# EasyEDA Pro project ADA4530_2025-03-15.epro, schematic Schematic4
Board Name: ADA4530-1; Create Date: 2025-03-06; Page Name: P1; Project Name: yuhuiceshi; Schematic Name: Schematic4; Update Date: 2025-03-07; Company: 嘉立创EDA; Page Size: A4; Version: V1.0
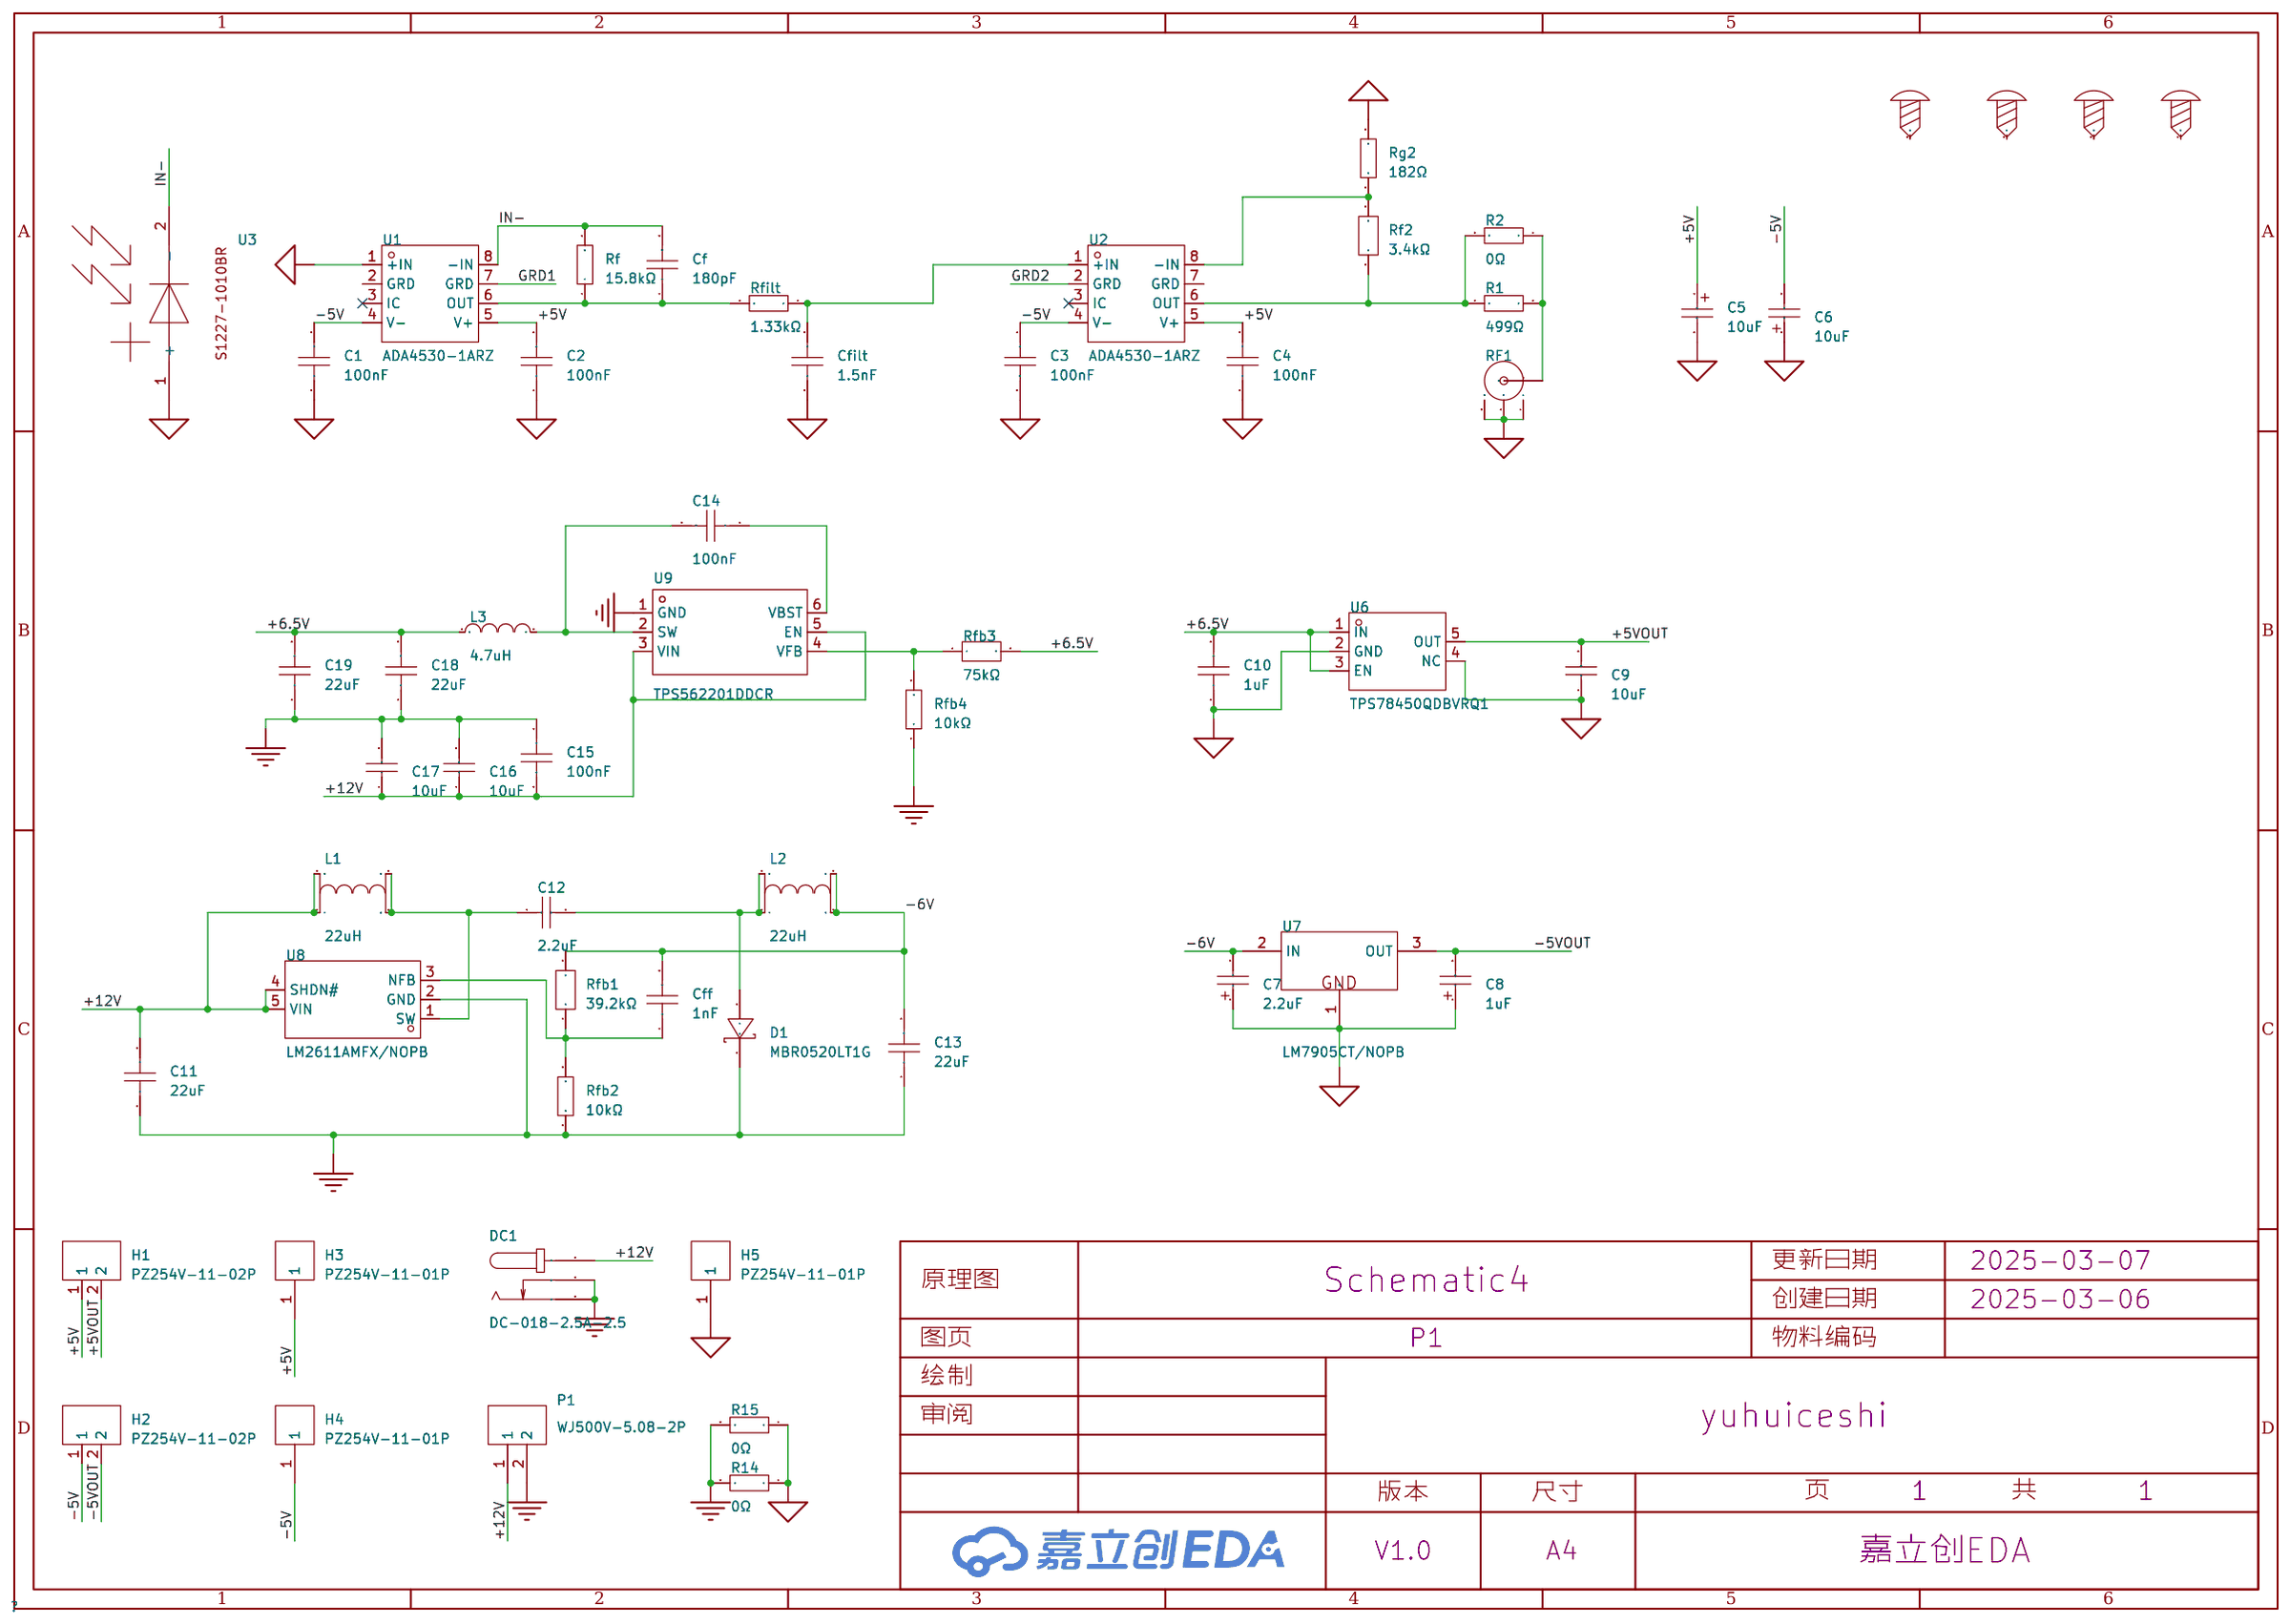
[diagram p4: schematic sheet]

## Parts
C1  100nF  [C0603]
C2  100nF  [C0603]
C3  100nF  [C0603]
C4  100nF  [C0603]
C5  10uF  [CAP-SMD_L6.0-W3.2-R-RD]
C6  10uF  [CAP-SMD_L6.0-W3.2-R-RD]
C7  2.2uF  [CASE-A_3216]
C8  1uF  [CASE-A_3216]
C9  10uF  [C1206]
C10  1uF  [C0603]
C11  22uF  [C1210]
C12  2.2uF  [C1206]
C13  22uF  [C1210]
C14  100nF  [C0603]
C15  100nF  [C0603]
C16  10uF  [C1206]
C17  10uF  [C1206]
C18  22uF  [C1210]
C19  22uF  [C1210]
Cf  180pF  [R0805]
Cff  1nF  [C0603]
Cfilt  1.5nF  [R0805]
D1  MBR0520LT1G  [SOD-123_L2.8-W1.8-LS3.7-RD]
DC1  DC-018-2.5A-2.5  [DC-IN-TH_DC-018]
H1  PZ254V-11-02P  [HDR-TH_2P-P2.54-V-M]
H2  PZ254V-11-02P  [HDR-TH_2P-P2.54-V-M]
H3  PZ254V-11-01P  [HDR-TH_1P-P2.54-V-M]
H4  PZ254V-11-01P  [HDR-TH_1P-P2.54-V-M]
H5  PZ254V-11-01P  [HDR-TH_1P-P2.54-V-M]
L1  22uH  [IND-SMD_4P-L3.8-W3.5_BL]
L2  22uH  [IND-SMD_4P-L3.8-W3.5_BL]
L3  4.7uH  [IND-SMD_L5.4-W5.2_FXL0530]
P1  WJ500V-5.08-2P  [CONN-TH_2P-P5.00_WJ500V-5.08-2P]
R1  499Ω  [R0603]
R2  0Ω  [R0603]
R14  0Ω  [R0603]
R15  0Ω  [R0603]
Rf  15.8kΩ  [R0805]
RF1  KH-BNC50-3511  [ANT-TH_KH-BNC50-3511]
Rf2  3.4kΩ  [R0805]
Rfb1  39.2kΩ  [R0805]
Rfb2  10kΩ  [R0805]
Rfb3  75kΩ  [R0805]
Rfb4  10kΩ  [R0805]
Rfilt  1.33kΩ  [R0805]
Rg2  182Ω  [R0805]
SCREW1  -  [M2螺丝]
SCREW2  -  [M2螺丝]
SCREW3  -  [M2螺丝]
SCREW4  -  [M2螺丝]
U1  ADA4530-1ARZ  [SOIC-8_L4.9-W3.9-P1.27-LS6.0-BL]
U2  ADA4530-1ARZ  [SOIC-8_L4.9-W3.9-P1.27-LS6.0-BL]
U3  -  [S1227-1010BR]
U6  TPS78450QDBVRQ1  [SOT-23-5_L2.9-W1.6-P0.95-LS2.8-BL]
U7  LM7905CT/NOPB  [TO-220-3_L10.0-W4.5-P2.54-L]
U8  LM2611AMFX/NOPB  [SOT-23-5_L2.9-W1.6-P0.95-LS2.8-BR]
U9  TPS562201DDCR  [SOT-23-6_L2.9-W1.6-P0.95-LS2.8-BR]

## Library data of the parts
C1-C4 C14 C15 = CC0603KRX7R9BB104: 容值:100nF;精度:±10%;额定电压:50V;材质(温度系数):X7R;; LCSC Part Name: 100nF ±10% 50V; Supplier Part: C14663; Manufacturer: YAGEO(国巨); Supplier Footprint: 0603; JLCPCB Part Class: 基础库; Datasheet: https://atta.szlcsc.com/upload/public/pdf/source/20180910/C282072_33301C7F631E79921B82A8DAC6BCC5B3.pdf; Supplier: LCSC; Tolerance: ±10%; Voltage Rated: 50V; Temperature Coefficient: X7R
C5 C6 = TAJC106K025RNJ: 容值:10uF;精度:±10%;额定电压:25V;等效串联电阻:1.8Ω@100kHz;; LCSC Part Name: 10uF ±10% 25V; Supplier Part: C7210; Manufacturer: Kyocera AVX; Supplier Footprint: CASE-C-6032; JLCPCB Part Class: Extended Part; Datasheet: https://atta.szlcsc.com/upload/public/pdf/source/20160107/1457707750344.pdf; Supplier: LCSC; Tolerance: ±10%; Rated Voltage: 25V; Equivalent Series Resistance(ESR): 1.8Ω@100kHz; Operating Temperature: -55℃~+125℃
C7 = TAJA225K016RNJ: 容值:2.2uF;精度:±10%;额定电压:16V;等效串联电阻:6.5Ω@100kHz;; LCSC Part Name: 2.2uF ±10% 16V; Supplier Part: C7180; Manufacturer: Kyocera AVX; Supplier Footprint: CASE-A-3216; JLCPCB Part Class: 扩展库; Datasheet: https://atta.szlcsc.com/upload/public/pdf/source/20160107/1457707750344.pdf; Supplier: LCSC; Tolerance: ±10%; Rated Voltage: 16V; Equivalent Series Resistance(ESR): 6.5Ω@100kHz; Operating Temperature: -55℃~+125℃
C8 = TAJA105K016RNJ: 容值:1uF;精度:±10%;额定电压:16V;等效串联电阻:11Ω;; LCSC Part Name: 1uF ±10% 16V; Supplier Part: C7174; Manufacturer: Kyocera AVX; Supplier Footprint: CASE-A-3216; JLCPCB Part Class: 扩展库; Datasheet: https://atta.szlcsc.com/upload/public/pdf/source/20160107/1457707750344.pdf; Supplier: LCSC; Tolerance: ±10%; Rated Voltage: 16V; Equivalent Series Resistance(ESR): 11Ω; Operating Temperature: -55℃~+125℃
C9 C16 C17 = CL31A106KAHNNNE: 容值:10uF;精度:±10%;额定电压:25V;材质(温度系数):X5R;; LCSC Part Name: 10uF ±10% 25V; Supplier Part: C9807; Manufacturer: SAMSUNG(三星); Supplier Footprint: 1206; JLCPCB Part Class: 扩展库; Datasheet: https://atta.szlcsc.com/upload/public/pdf/source/20160218/1457707763339.pdf; Supplier: LCSC; Tolerance: ±10%; Voltage Rated: 25V; Temperature Coefficient: X5R
C10 = CL10A105KB8NNNC: 容值:1uF;精度:±10%;额定电压:50V;材质(温度系数):X5R;; LCSC Part Name: 1uF ±10% 50V; Supplier Part: C15849; Manufacturer: SAMSUNG(三星); Supplier Footprint: 0603; JLCPCB Part Class: 基础库; Datasheet: https://atta.szlcsc.com/upload/public/pdf/source/20160218/1457707763339.pdf; Supplier: LCSC; Tolerance: ±10%; Voltage Rated: 50V; Temperature Coefficient: X5R
C11 C13 C18 C19 = GMK325BJ226MM-P: 容值:22uF;精度:±20%;额定电压:35V;材质(温度系数):X5R;; LCSC Part Name: 22uF ±20% 35V; Supplier Part: C778721; Manufacturer: TAIYO YUDEN(太诱); Supplier Footprint: 1210; JLCPCB Part Class: 扩展库; Datasheet: https://atta.szlcsc.com/upload/public/pdf/source/20200107/C471398_4D150C2F82D9DF0CFE325EE548591887.pdf; Supplier: LCSC; Tolerance: ±20%; Voltage Rated: 35V; Temperature Coefficient: X5R
C12 = CC1206KKX7R7BB225: 容值:2.2uF;精度:±10%;额定电压:16V;材质(温度系数):X7R;; LCSC Part Name: 2.2uF ±10% 16V; Supplier Part: C107183; Manufacturer: YAGEO(国巨); Supplier Footprint: 1206; JLCPCB Part Class: 扩展库; Datasheet: https://atta.szlcsc.com/upload/public/pdf/source/20170914/C128857_1505359892143968080.pdf; Supplier: LCSC; Tolerance: ±10%; Voltage Rated: 16V; Temperature Coefficient: X7R
Cf = 0805CG181J500NT: 容值:180pF;精度:±5%;额定电压:50V;材质(温度系数):C0G;; LCSC Part Name: 180pF ±5% 50V; Supplier Part: C501859; Manufacturer: FH(风华); Supplier Footprint: 0805; JLCPCB Part Class: 扩展库; Datasheet: https://atta.szlcsc.com/upload/public/pdf/source/20200305/C486355_26A10D38EF8C2A5C37091D0039909270.pdf; Supplier: LCSC; Tolerance: ±5%; Voltage Rated: 50V; Temperature Coefficient: C0G
Cff = GRM1885C1H102JA01D: 容值:1nF;精度:±5%;额定电压:50V;材质(温度系数):C0G;; LCSC Part Name: 1nF ±5% 50V; Supplier Part: C77026; Manufacturer: muRata(村田); Supplier Footprint: 0603; JLCPCB Part Class: 扩展库; Datasheet: https://atta.szlcsc.com/upload/public/pdf/source/20200305/C490387_23319AE8C154DEB24C505E6C82A8106A.pdf; Supplier: LCSC; Tolerance: ±5%; Voltage Rated: 50V; Temperature Coefficient: C0G
Cfilt = CC0805FRNPO9BN152: 容值:1.5nF;精度:±1%;额定电压:50V;材质(温度系数):NP0;; LCSC Part Name: 1.5nF ±1% 50V; Supplier Part: C541572; Manufacturer: YAGEO(国巨); Supplier Footprint: 0805; JLCPCB Part Class: 扩展库; Datasheet: https://atta.szlcsc.com/upload/public/pdf/source/20200615/C541572_75B017E42B81E12B0DEAEB7B17D8F495.pdf; Supplier: LCSC; Tolerance: ±1%; Voltage Rated: 50V; Temperature Coefficient: NP0
D1 = MBR0520LT1G: 正向压降(Vf):385mV@500mA;直流反向耐压(Vr):20V;平均整流电流(Io):500mA;; LCSC Part Name: 电压:20V 电流:500mA; Supplier Part: C23848; Manufacturer: onsemi(安森美); Supplier Footprint: SOD-123; JLCPCB Part Class: 扩展库; Datasheet: https://atta.szlcsc.com/upload/public/pdf/source/20200107/C165467_B46770004CC25E9EEC451D5DBE275EFE.pdf; Supplier: LCSC; Forward Voltage (Vf@If): 385mV@500mA; Reverse Voltage (Vr): 20V; Average Rectified Current (Io): 500mA; Reverse Leakage Current (Ir): 250uA@20V
DC1 = DC-018-2.5A-2.5: 连接器类型:DC电源插座;安装方式:直插;触点内径:2.5mm;触点外径:5.5mm;额定电流:2.5A;额定电压:24V;工作温度范围:-20℃~+70℃;; LCSC Part Name: DC电源插座 内径:2.5mm 外径:5.5mm; Supplier Part: C2880553; Manufacturer: XKB Connection(中国星坤); Supplier Footprint: 插件; JLCPCB Part Class: 扩展库; Datasheet: https://atta.szlcsc.com/upload/public/pdf/source/20211011/841513E81FE39239E013AD10F679532A.pdf; Supplier: LCSC; Connector Type: DC电源插座; Mounting Style: 直插; Inside Contact Diameter: 2.5mm; Outside Contact Diameter: 5.5mm; Current Rating (Max): 2.5A; Voltage Rating (Max): 24V; Operating Temperature Range: -20℃~+70℃
H1 H2 = PZ254V-11-02P: 插针结构:1x2P;间距:2.54mm;行距:-;圆针/方针:方针;安装类型:直插;排数:单排;总PIN位数:2P;额定电流:-;额定电压:-;配合针长度:6mm;塑高:2.5mm;端接针长度:3mm;触头材质:黄铜;触头镀层:-;工作温度范围:-40℃~+105℃;颜色:黑色;; LCSC Part Name: 间距:2.54mm 1x2P 直插 方针; Supplier Part: C492401; Manufacturer: XFCN(兴飞); Supplier Footprint: 插件,P=2.54mm; JLCPCB Part Class: 扩展库; Datasheet: https://atta.szlcsc.com/upload/public/pdf/source/20200309/C492401_A812433581A9B211A7FFA413ADDFF0E5.pdf; Supplier: LCSC; Pin Structure: 1x2P; Pitch: 2.54mm; Circluar Pins/Square Pins: 方针; Mounting Type: 直插; Number of Rows: 单排; Number of Pins: 2P; Length of Mating Pin: 6mm; Insulation Height: 2.5mm; Length of End Connection Pin: 3mm; Contact Material: 黄铜; Operating Temperature Range: -40℃~+105℃; Color: 黑色
H3-H5 = PZ254V-11-01P: 插针结构:1x1P;间距:2.54mm;行距:-;圆针/方针:方针;安装方式:直插;排数:单排;总PIN位数:1P;额定电流:-;额定电压:-;配合针长度:6mm;塑高:2.5mm;端接针长度:3mm;触头材质:黄铜;触头镀层:-;工作温度:-40℃~+105℃;颜色:黑色;; LCSC Part Name: 1x1P 间距:2.54mm 方针 直插; Supplier Part: C492400; Manufacturer: XFCN(兴飞); Supplier Footprint: 插件,P=2.54mm; JLCPCB Part Class: 扩展库; Datasheet: https://atta.szlcsc.com/upload/public/pdf/source/20200309/C492400_46876A5B545F5AE6B8D4A09C46E276E8.pdf; Supplier: LCSC; Pin Structure: 1x1P; Pitch: 2.54mm; Circluar Pins/Square Pins: 方针; Mounting Type: 直插; Number of Rows: 单排; Number of Pins: 1P; Length of Mating Pin: 6mm; Insulation Height: 2.5mm; Length of End Connection Pin: 3mm; Contact Material: 黄铜; Operating Temperature: -40℃~+105℃; Color: 黑色
L1 L2 = CR32NP-220KC: 电感值:22uH;精度:±10%;额定电流:500mA;饱和电流(Isat):-;类型:-;; LCSC Part Name: 22uH ±10%; Supplier Part: C167313; Manufacturer: Sumida(胜美达); Supplier Footprint: SMD-4P,3.8x3.5mm; JLCPCB Part Class: 扩展库; Datasheet: https://atta.szlcsc.com/upload/public/pdf/source/20180224/C167313_15194366459971363664.pdf; Supplier: LCSC; Tolerance: ±10%; Rated Current: 500mA; DC Resistance (DCR): 470mΩ
L3 = FXL0530-4R7-M: 电感值:4.7uH;精度:±20%;额定电流:4.5A;饱和电流(Isat):5A;类型:一体成型电感;; LCSC Part Name: 4.7uH ±20% 5A; Supplier Part: C177246; Manufacturer: cjiang(长江微电); Supplier Footprint: SMD,5.2x5.4mm; JLCPCB Part Class: 扩展库; Datasheet: https://atta.szlcsc.com/upload/public/pdf/source/20240426/3189EA8206330E2108542F9E34E540E7.pdf; Supplier: LCSC; Tolerance: ±20%; Rated Current: 4.5A; Saturation Current (Isat): 5A; DC Resistance (DCR): 60mΩ; Type: 一体成型电感
P1 = WJ500V-5.08-2P: 结构:1x2P;间距:5.08mm;颜色:绿色;安装方式:直插;额定电流:18A;额定电压:250V;排数:1;线规 - AWG:14~30;线规 - 平方毫米:2.5;每排PIN数:2;触头材质:-;触头镀层:-;工作温度范围:-40℃~+105℃;焊接温度(最大值):-;; LCSC Part Name: 1x2P 5.08mm 直插 排数:1 每排P数:2; Supplier Part: C8465; Manufacturer: KANGNEX(康奈克斯电气); Supplier Footprint: 插件,P=5.08mm; JLCPCB Part Class: 扩展库; Datasheet: https://atta.szlcsc.com/upload/public/pdf/source/20191225/C8465_02D34CE5B5B4A53DF5891601D97FA9F4.pdf; Supplier: LCSC; Structure: 1x2P; Pitch: 5.08mm; Color: 绿色; Mounting Style: 直插; Current Rating (Max): 18A; Voltage Rating (Max): 250V; Number of Pins: 2P; Number of Rows: 1; Wire Gauge - AWG: 14~30; Wire Gauge - mm2: 2.5; Number of PINs Per Row: 2; Operating Temperature Range: -40℃~+105℃; Screw Specification: M2.5
R1 = 0603WAF4990T5E: 电阻类型:厚膜电阻;阻值:499Ω;精度:±1%;功率:100mW;最大工作电压:75V;温度系数:±100ppm/℃;; LCSC Part Name: 499Ω ±1% 100mW 厚膜电阻; Supplier Part: C23065; Manufacturer: UNI-ROYAL(厚声); Supplier Footprint: 0603; JLCPCB Part Class: 扩展库; Datasheet: https://atta.szlcsc.com/upload/public/pdf/source/20200306/C422600_1E6D84923E4A46A82E41ADD87F860B5C.pdf; Supplier: LCSC; Type: 厚膜电阻; Tolerance: ±1%; Power(Watts): 100mW; Overload Voltage (Max): 75V; Temperature Coefficient: ±100ppm/℃; Operating Temperature Range: -55℃~+155℃
R2 R14 R15 = 0603WAF0000T5E: 电阻类型:厚膜电阻;阻值:0Ω;精度:±1%;功率:100mW;最大工作电压:75V;; LCSC Part Name: 0Ω ±1% 100mW 厚膜电阻; Supplier Part: C21189; Manufacturer: UNI-ROYAL(厚声); Supplier Footprint: 0603; JLCPCB Part Class: 基础库; Datasheet: https://atta.szlcsc.com/upload/public/pdf/source/20200306/C422600_1E6D84923E4A46A82E41ADD87F860B5C.pdf; Supplier: LCSC; Type: 厚膜电阻; Tolerance: ±1%; Power(Watts): 100mW; Overload Voltage (Max): 75V; Operating Temperature Range: -55℃~+155℃
Rf = 0805W8F1582T5E: 电阻类型:厚膜电阻;阻值:15.8kΩ;精度:±1%;功率:125mW;最大工作电压:150V;温度系数:±100ppm/℃;; LCSC Part Name: 15.8kΩ ±1% 125mW 厚膜电阻; Supplier Part: C17468; Manufacturer: UNI-ROYAL(厚声); Supplier Footprint: 0805; JLCPCB Part Class: 扩展库; Datasheet: https://atta.szlcsc.com/upload/public/pdf/source/20200306/C422600_1E6D84923E4A46A82E41ADD87F860B5C.pdf; Supplier: LCSC; Type: 厚膜电阻; Tolerance: ±1%; Power(Watts): 125mW; Overload Voltage (Max): 150V; Temperature Coefficient: ±100ppm/℃; Operating Temperature Range: -55℃~+155℃
RF1 = KH-BNC50-3511: 连接器类型:板端;接口类型:内孔;端口数量:1;接口直径:9.5mm;接口长度/高度:-;频率-最大值:3GHz;射频系列:BNC;阻抗:50Ω;样式:弯头;工作温度范围:-55℃~+155℃;; LCSC Part Name: BNC 内孔 弯头; Supplier Part: C2837587; Manufacturer: kinghelm(金航标); Supplier Footprint: 插件; JLCPCB Part Class: 扩展库; Datasheet: https://atta.szlcsc.com/upload/public/pdf/source/20221123/AFF24A942BB0EF6B7776F494013BE75C.pdf; Supplier: LCSC; Connector Type: 板端; Interface Type: 内孔; Number of Ports: 1; Interface Diameter: 9.5mm; Frequency-Max: 3GHz; RF Series: BNC; Impedance: 50Ω; Style: 弯头; Operating Temperature Range: -55℃~+155℃
Rf2 = PTFR0805B3K40P9: 电阻类型:薄膜电阻;阻值:3.4kΩ;精度:±0.1%;功率:130mW;最大工作电压:150V;温度系数:±25ppm/℃;; LCSC Part Name: 薄膜电阻 3.4kΩ ±0.1% 130mW; Supplier Part: C2849214; Manufacturer: RESI(开步睿思); Supplier Footprint: 0805; JLCPCB Part Class: 扩展库; Datasheet: https://atta.szlcsc.com/upload/public/pdf/source/20240506/11BDC7478D84177AC2A5326A65B6EB29.pdf; Supplier: LCSC; Type: 薄膜电阻; Tolerance: ±0.1%; Power(Watts): 130mW; Overload Voltage (Max): 150V; Temperature Coefficient: ±25ppm/℃; Operating Temperature Range: -55℃~+155℃
Rfb1 = RC0805FR-0739K2L: 电阻类型:厚膜电阻;阻值:39.2kΩ;精度:±1%;功率:125mW;最大工作电压:150V;温度系数:±100ppm/℃;; LCSC Part Name: 厚膜电阻 39.2kΩ ±1% 125mW; Supplier Part: C273844; Manufacturer: YAGEO(国巨); Supplier Footprint: 0805; JLCPCB Part Class: 扩展库; Datasheet: https://atta.szlcsc.com/upload/public/pdf/source/20191125/C364360_EA870FADD46A2AD4DBE56DD50D360B3E.pdf; Supplier: LCSC; Type: 厚膜电阻; Tolerance: ±1%; Power(Watts): 125mW; Overload Voltage (Max): 150V; Temperature Coefficient: ±100ppm/℃; Operating Temperature Range: -55℃~+155℃
Rfb2 Rfb4 = 0805W8F1002T5E_C17414: 电阻类型:厚膜电阻;阻值:10kΩ;精度:±1%;功率:125mW;最大工作电压:150V;温度系数:±100ppm/℃;; LCSC Part Name: 10kΩ ±1% 125mW 厚膜电阻; Supplier Part: C17414; Manufacturer: UNI-ROYAL(厚声); Manufacturer Part: 0805W8F1002T5E; Supplier Footprint: 0805; JLCPCB Part Class: 基础库; Datasheet: https://atta.szlcsc.com/upload/public/pdf/source/20200306/C422600_1E6D84923E4A46A82E41ADD87F860B5C.pdf; Supplier: LCSC; Type: 厚膜电阻; Tolerance: ±1%; Power(Watts): 125mW; Overload Voltage (Max): 150V; Temperature Coefficient: ±100ppm/℃; Operating Temperature Range: -55℃~+155℃
Rfb3 = FRC0805J753TS: 电阻类型:厚膜电阻;阻值:75kΩ;精度:±5%;功率:125mW;最大工作电压:150V;温度系数:±100ppm/℃;; LCSC Part Name: 75kΩ ±5% 125mW 厚膜电阻; Supplier Part: C2930313; Manufacturer: FOJAN(富捷); Supplier Footprint: 0805; JLCPCB Part Class: 扩展库; Datasheet: https://atta.szlcsc.com/upload/public/pdf/source/20211221/925EC7D7225764EE0046F22065062C87.pdf; Supplier: LCSC; Type: 厚膜电阻; Tolerance: ±5%; Power(Watts): 125mW; Overload Voltage (Max): 150V; Temperature Coefficient: ±100ppm/℃; Operating Temperature Range: -55℃~+155℃
Rfilt = 0805W8F1582T5E: 电阻类型:厚膜电阻;阻值:15.8kΩ;精度:±1%;功率:125mW;最大工作电压:150V;温度系数:±100ppm/℃;; LCSC Part Name: 15.8kΩ ±1% 125mW 厚膜电阻; Supplier Part: C865258; Manufacturer: YAGEO(国巨); Manufacturer Part: RT0805BRD071K33L; Supplier Footprint: 0805; JLCPCB Part Class: 扩展库; Datasheet: https://atta.szlcsc.com/upload/public/pdf/source/20200306/C422600_1E6D84923E4A46A82E41ADD87F860B5C.pdf; Supplier: LCSC; Type: 厚膜电阻; Tolerance: ±1%; Power(Watts): 125mW; Overload Voltage (Max): 150V; Temperature Coefficient: ±100ppm/℃; Operating Temperature Range: -55℃~+155℃
Rg2 = 0805W8F1820T5E: 电阻类型:厚膜电阻;阻值:182Ω;精度:±1%;功率:125mW;最大工作电压:150V;温度系数:±100ppm/℃;; LCSC Part Name: 182Ω ±1% 125mW 厚膜电阻; Supplier Part: C17503; Manufacturer: UNI-ROYAL(厚声); Supplier Footprint: 0805; JLCPCB Part Class: 扩展库; Datasheet: https://atta.szlcsc.com/upload/public/pdf/source/20200306/C422600_1E6D84923E4A46A82E41ADD87F860B5C.pdf; Supplier: LCSC; Type: 厚膜电阻; Tolerance: ±1%; Power(Watts): 125mW; Overload Voltage (Max): 150V; Temperature Coefficient: ±100ppm/℃; Operating Temperature Range: -55℃~+155℃
SCREW1-SCREW4 = M2螺丝: Supplier Footprint: 插件; Check: false
U1 U2 = ADA4530-1ARZ: 放大器数:单路;轨到轨:轨到轨输出;增益带宽积(GBP):2MHz;输入失调电压(Vos):300uV;压摆率(SR):1.4V/us;输入偏置电流(Ib):0.02pA;; LCSC Part Name: 飞安级输入偏置电流静电计放大器; Supplier Part: C654128; Manufacturer: ADI(亚德诺); Supplier Footprint: SOIC-8; JLCPCB Part Class: 扩展库; Datasheet: https://atta.szlcsc.com/upload/public/pdf/source/20200729/C654128_C8802637E08A58373167ED8215F15F2A.pdf; Supplier: LCSC; Number of Circuits: 单路; Maximum Power Supply Range (Vdd-Vss): 16V; Rail to Rail: 轨到轨输出; Gain Bandwidth Product(GBP): 2MHz; Voltage - Input Offset(Vos): 300uV; Input Offset Voltage Drift (Vos TC): 2.8uV/℃; Slew Rate(SR): 1.4V/us; Current - Input Bias(Ib): 0.02pA; Noise density(eN): 14nV/√Hz@10kHz; Common Mode Rejection Ratio (CMRR): 114dB; Output Current: 15mA; Operating Temperature: -40℃~+125℃
U3 = SiPD: Check: false
U6 = TPS78450QDBVRQ1: 输出类型:固定;最大输入电压:6V;输出电压:5V;输出电流:300mA;输出极性:正极;; LCSC Part Name: 具有高精度和使能功能的汽车类 300mA、低 IQ、高 PSRR LDO 稳压器; Supplier Part: C2877783; Manufacturer: TI(德州仪器); Supplier Footprint: SOT-23-5; JLCPCB Part Class: 扩展库; Datasheet: https://www.ti.com/cn/lit/gpn/tps784-q1; Supplier: LCSC; Output Type: 固定; Maximum Input Voltage: 6V; Output Voltage: 5V; Output Current: 300mA; Dropout Voltage: 115mV@(300mA); standby current: 40uA; Operating Temperature: -40℃~+150℃@(Tj); Output Polarity: 正极; Number of Outputs: 1
U7 = LM7905CT/NOPB: 输出类型:固定;最大输入电压:25V;输出电压:5V;输出电流:1.5A;电源纹波抑制比(PSRR):66dB@(120Hz);输出极性:负极;; LCSC Part Name: 1.5A 负电压线性稳压器; Supplier Part: C352863; Manufacturer: TI(德州仪器); Supplier Footprint: TO-220; JLCPCB Part Class: 扩展库; Datasheet: https://www.ti.com/cn/lit/gpn/lm79; Supplier: LCSC; Output Type: 固定; Maximum Input Voltage: 25V; Output Voltage: 5V; Output Current: 1.5A; Power Supply Rejection Ratio (PSRR): 66dB@(120Hz); Dropout Voltage: 1.1V@(1A); standby current: 1mA; Feature: 防静电保护；热保护(TSD)；过流保护(OCP); Operating Temperature: 0℃~+125℃; Output Polarity: 负极; Number of Outputs: 1
U8 = LM2611AMFX/NOPB: 功能类型:升降压型;输出类型:可调;输入电压:2.7V~14V;输出电压:-32V~-1.23V;输出电流(最大值):1.2A;; Supplier Part: C2072505; Manufacturer: TI(德州仪器); Supplier Footprint: SOT-23-5; JLCPCB Part Class: 扩展库; Datasheet: https://www.ti.com/cn/lit/gpn/lm2611; Supplier: LCSC; Function: 升降压型; Output Type: 可调; Input Voltage: 2.7V~14V; Output Voltage: -32V~-1.23V; Output Current (Max): 1.2A; Switching Frequency: 1.4MHz; Operating Temperature: -40℃~+125℃@(TJ); Synchronous Rectification: 否; Number of Outputs: 1; Topology: Cuk; Switch tube (built-in/external): 内置
U9 = TPS562201DDCR: 功能类型:降压型;输出类型:可调;输入电压:4.5V~17V;输出电压:768mV~7V;输出电流:2A;; Supplier Part: C90061; Manufacturer: TI(德州仪器); Supplier Footprint: SOT-6; JLCPCB Part Class: 扩展库; Datasheet: https://www.ti.com/cn/lit/gpn/tps562201; Supplier: LCSC; Function: 降压型; Output Type: 可调; Input Voltage: 4.5V~17V; Output Voltage: 768mV~7V; Output Current: 2A; Switching Frequency: 580kHz; Operating Temperature: -40℃~+125℃@(TJ); Synchronous Rectification: 是; Number of Outputs: 1; Topology: 降压式; Switch tube (built-in/external): 内置

## Nets
+5V: C2.2 C4.2 C5.1 H1.1 H3.1 U1.5(V+) U2.5(V+)
+5VOUT: C9.2 H1.2 U6.5(OUT)
+6.5V: C10.2 C18.2 C19.2 L3.1 Rfb3.2 U6.1(IN) U6.3(EN)
+12V: C11.2 C15.2 C16.1 C17.1 DC1.1 L1.1 L1.4 P1.1 U8.4(SHDN#) U8.5(VIN) U9.3(VIN) U9.5(EN)
-5V: C1.2 C3.1 C6.2 H2.1 H4.1 U1.4(V-) U2.4(V-)
-5VOUT: C8.2 H2.2 U7.3(OUT)
-6V: C7.2 C13.2 Cff.2 L2.2 L2.3 Rfb1.2 U7.2(IN)
AGND: C1.1 C2.1 C3.2 C4.1 C5.2 C6.1 C7.1 C8.1 C9.1 C10.1 Cfilt.1 H5.1 R14.1 R15.1 RF1.2 RF1.3 RF1.4 Rg2.2 U1.1(+IN) U3.1(+) U6.2(GND) U6.4(NC) U7.1(GND)
GND: C11.1 C13.1 C15.1 C16.2 C17.2 C18.1 C19.1 D1.1(C) DC1.2 DC1.3 P1.2 R14.2 R15.2 Rfb2.1 Rfb4.1 U8.2(GND) U9.1(GND)
GRD1: U1.7(GRD)
GRD2: U2.2(GRD)
IN-: Cf.2 Rf.2 U1.8(-IN) U3.2(-)
$1N1239: Cf.1 Rf.1 Rfilt.2 U1.6(OUT)
$1N1441: Cfilt.2 Rfilt.1 U2.1(+IN)
$1N1504: R1.1 R2.2 Rf2.1 U2.6(OUT)
$1N1510: Rf2.2 Rg2.1 U2.8(-IN)
$1N1693: R1.2 R2.1 RF1.1(OUT)
$1N3691: C12.1 L1.2 L1.3 U8.1(SW)
$1N3697: Cff.1 Rfb1.1 Rfb2.2 U8.3(NFB)
$1N3853: C12.2 D1.2(A) L2.1 L2.4
$1N5017: C14.2 L3.2 U9.2(SW)
$1N5032: C14.1 U9.6(VBST)
$1N5055: Rfb3.1 Rfb4.2 U9.4(VFB)

Not connected (* = marked no-connect by the designer): SCREW1 1; SCREW2 1; SCREW3 1; SCREW4 1; U1 2(GRD) 3(IC)*; U2 3(IC)* 7(GRD)
